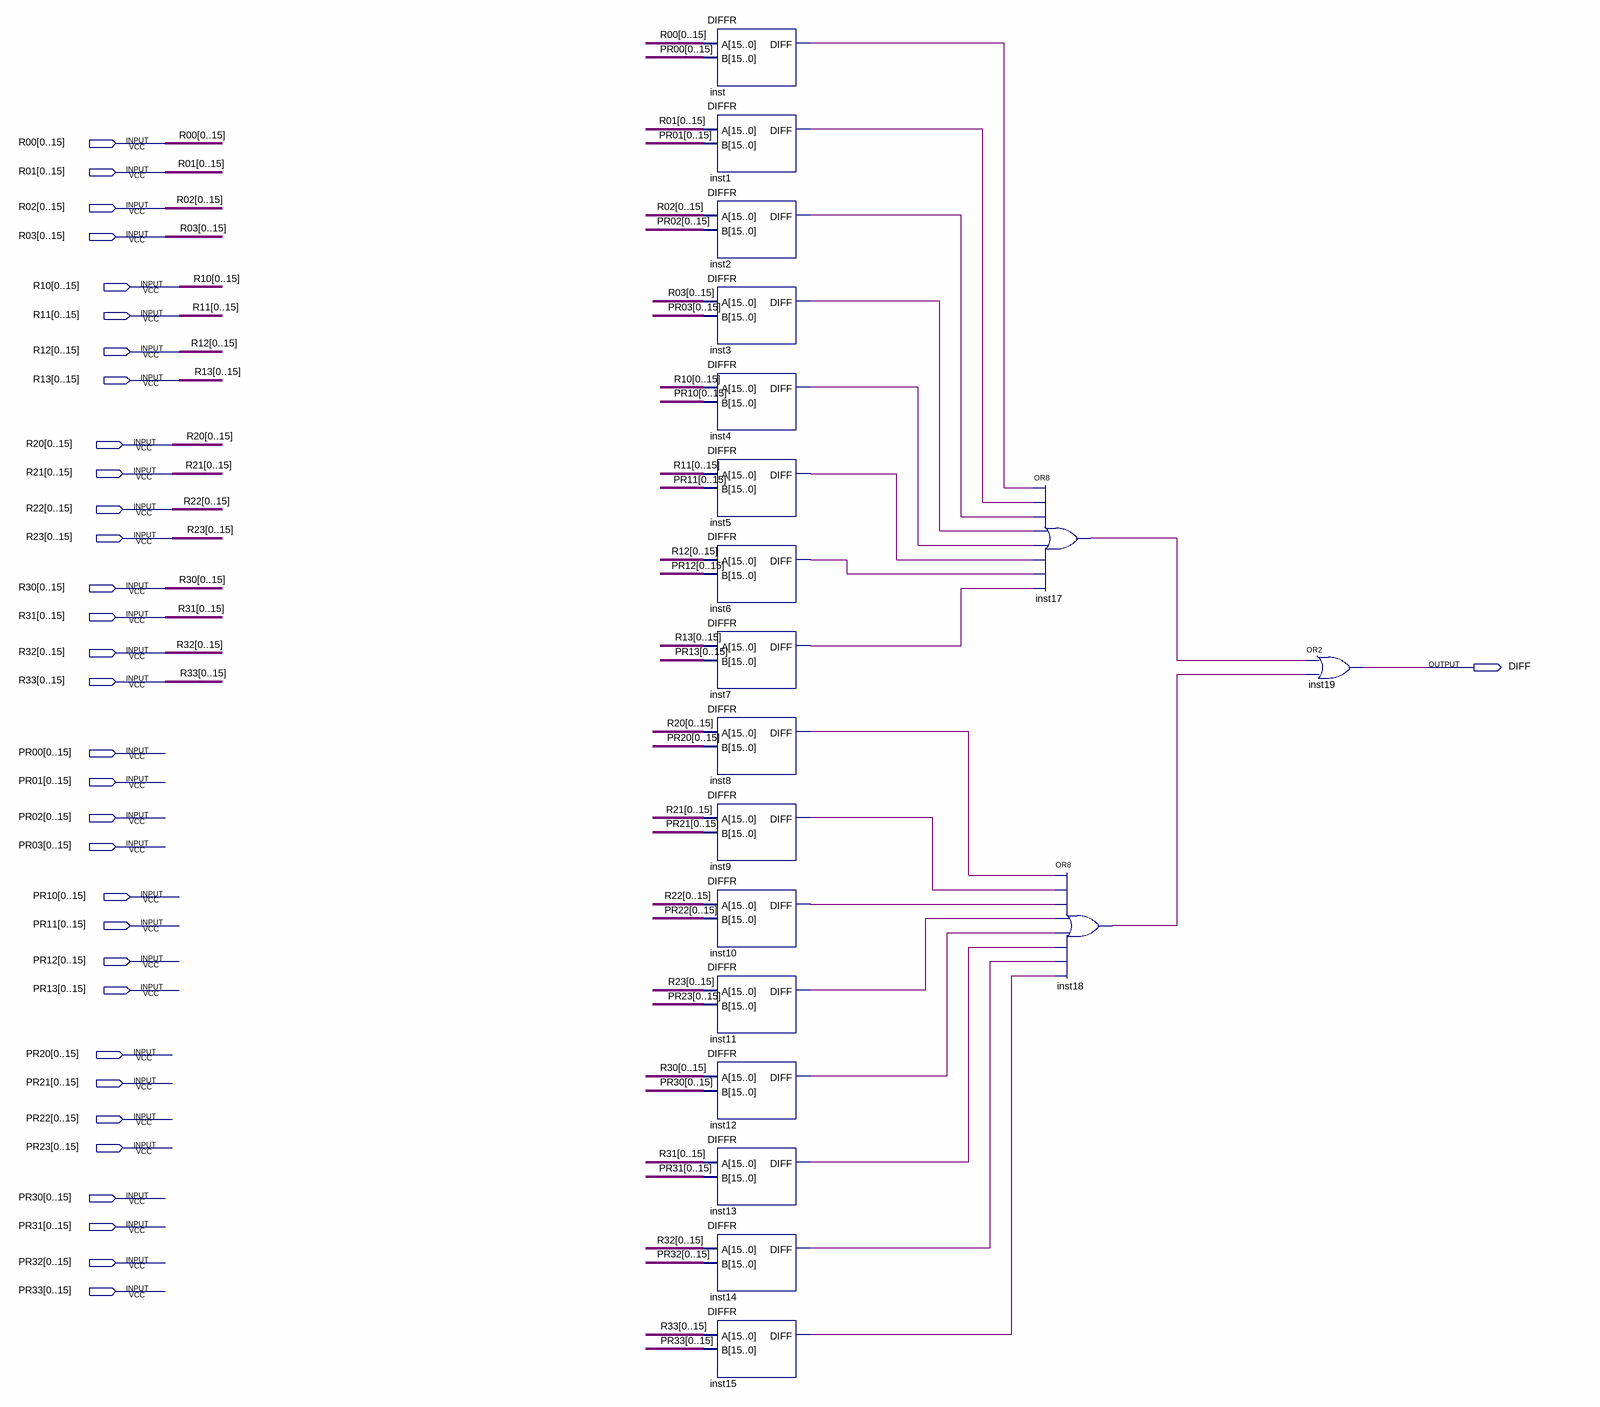
[diagram p0: schematic sheet]
// Quartus schematic CHECKER.bdf as structural Verilog: 19 symbols, 33 pins
module CHECKER (
  input  [0:15] R00,
  input  [0:15] R01,
  input  [0:15] R02,
  input  [0:15] R03,
  input  [0:15] R10,
  input  [0:15] R11,
  input  [0:15] R12,
  input  [0:15] R13,
  input  [0:15] R20,
  input  [0:15] R21,
  input  [0:15] R22,
  input  [0:15] R23,
  input  [0:15] R30,
  input  [0:15] R31,
  input  [0:15] R32,
  input  [0:15] R33,
  input  [0:15] PR00,
  input  [0:15] PR01,
  input  [0:15] PR02,
  input  [0:15] PR03,
  input  [0:15] PR10,
  input  [0:15] PR11,
  input  [0:15] PR12,
  input  [0:15] PR13,
  input  [0:15] PR20,
  input  [0:15] PR21,
  input  [0:15] PR22,
  input  [0:15] PR23,
  input  [0:15] PR30,
  input  [0:15] PR31,
  input  [0:15] PR32,
  input  [0:15] PR33,
  output DIFF
);

  wire inst1_diff, inst2_diff, inst3_diff, inst4_diff, inst5_diff, inst6_diff, inst7_diff, inst8_diff,
       inst9_diff, inst10_diff, inst11_diff, inst12_diff, inst13_diff, inst14_diff, inst15_diff, inst17_out,
       inst18_out, inst_diff;

  DIFFR inst (.A(R00), .B(PR00), .DIFF(inst_diff));
  DIFFR inst1 (.A(R01), .B(PR01), .DIFF(inst1_diff));
  DIFFR inst2 (.A(R02), .B(PR02), .DIFF(inst2_diff));
  DIFFR inst3 (.A(R03), .B(PR03), .DIFF(inst3_diff));
  DIFFR inst4 (.A(R10), .B(PR10), .DIFF(inst4_diff));
  DIFFR inst5 (.A(R11), .B(PR11), .DIFF(inst5_diff));
  DIFFR inst6 (.A(R12), .B(PR12), .DIFF(inst6_diff));
  DIFFR inst7 (.A(R13), .B(PR13), .DIFF(inst7_diff));
  DIFFR inst8 (.A(R20), .B(PR20), .DIFF(inst8_diff));
  DIFFR inst9 (.A(R21), .B(PR21), .DIFF(inst9_diff));
  DIFFR inst10 (.A(R22), .B(PR22), .DIFF(inst10_diff));
  DIFFR inst11 (.A(R23), .B(PR23), .DIFF(inst11_diff));
  DIFFR inst12 (.A(R30), .B(PR30), .DIFF(inst12_diff));
  DIFFR inst13 (.A(R31), .B(PR31), .DIFF(inst13_diff));
  DIFFR inst14 (.A(R32), .B(PR32), .DIFF(inst14_diff));
  DIFFR inst15 (.A(R33), .B(PR33), .DIFF(inst15_diff));
  or inst17 (inst17_out, inst_diff, inst1_diff, inst2_diff, inst3_diff, inst4_diff, inst5_diff, inst6_diff, inst7_diff);
  or inst18 (inst18_out, inst8_diff, inst9_diff, inst10_diff, inst11_diff, inst12_diff, inst13_diff, inst14_diff, inst15_diff);
  or inst19 (DIFF, inst17_out, inst18_out);
endmodule
